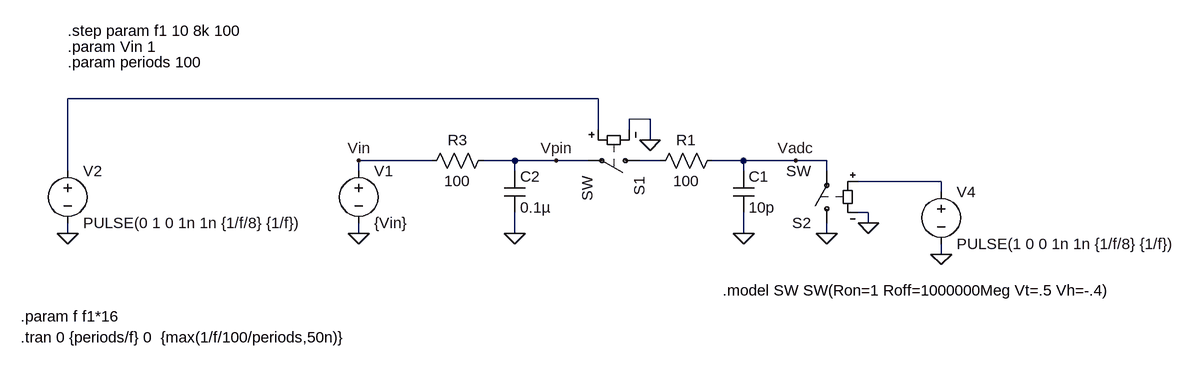
[diagram p0: schematic SettleTime.asc]
SettleTime.asc, the LTspice schematic file:
Version 4
SHEET 1 1796 680
WIRE 48 48 -768 48
WIRE 128 80 96 80
WIRE 48 96 48 48
WIRE 96 96 96 80
WIRE 128 112 128 80
WIRE -208 144 -320 144
WIRE -80 144 -128 144
WIRE -16 144 -80 144
WIRE 32 144 -16 144
WIRE 144 144 112 144
WIRE 272 144 224 144
WIRE 352 144 272 144
WIRE 400 144 352 144
WIRE -768 160 -768 48
WIRE -320 160 -320 144
WIRE -80 160 -80 144
WIRE 272 160 272 144
WIRE 400 160 400 144
WIRE 576 176 448 176
WIRE 576 192 576 176
WIRE 464 224 448 224
WIRE 464 240 464 224
WIRE -768 256 -768 240
WIRE -320 256 -320 240
WIRE -80 256 -80 224
WIRE 272 256 272 224
WIRE 400 256 400 240
WIRE 576 288 576 272
FLAG 272 256 0
FLAG -80 256 0
FLAG -320 256 0
FLAG 128 112 0
FLAG -768 256 0
FLAG -320 144 Vin
FLAG 352 144 Vadc
FLAG 464 240 0
FLAG 576 288 0
FLAG -16 144 Vpin
FLAG 400 256 0
SYMBOL cap 256 160 R0
SYMATTR InstName C1
SYMATTR Value 10p
SYMBOL res 240 128 R90
WINDOW 0 0 56 VBottom 2
WINDOW 3 32 56 VTop 2
SYMATTR InstName R1
SYMATTR Value 100
SYMBOL res -112 128 R90
WINDOW 0 0 56 VBottom 2
WINDOW 3 32 56 VTop 2
SYMATTR InstName R3
SYMATTR Value 100
SYMBOL cap -96 160 R0
SYMATTR InstName C2
SYMATTR Value 0.1µ
SYMBOL voltage -320 144 R0
WINDOW 123 0 0 Left 0
WINDOW 39 0 0 Left 0
SYMATTR InstName V1
SYMATTR Value {Vin}
SYMBOL sw 128 144 R90
SYMATTR InstName S1
SYMBOL voltage -768 144 R0
WINDOW 123 0 0 Left 0
WINDOW 39 0 0 Left 0
SYMATTR InstName V2
SYMATTR Value PULSE(0 1 0 1n 1n {1/f/8} {1/f})
SYMBOL sw 400 256 R180
SYMATTR InstName S2
SYMBOL voltage 576 176 R0
WINDOW 123 0 0 Left 0
WINDOW 39 0 0 Left 0
SYMATTR InstName V4
SYMATTR Value PULSE(1 0 0 1n 1n {1/f/8} {1/f})
TEXT 240 344 Left 2 !.model SW SW(Ron=1 Roff=1000000Meg Vt=.5 Vh=-.4)
TEXT -840 416 Left 2 !.tran 0 {periods/f} 0  {max(1/f/100/periods,50n)}
TEXT -768 -32 Left 2 !.param Vin 1
TEXT -840 384 Left 2 !.param f f1*16
TEXT -768 -56 Left 2 !.step param f1 10 8k 100
TEXT -768 -8 Left 2 !.param periods 100

The netlist it stands for:
* SettleTime.asc
C1 Vadc 0 10p
R1 Vadc N002 100
R3 Vpin Vin 100
C2 Vpin 0 0.1µ
V1 Vin 0 {Vin}
S1 N002 Vpin N001 0 SW
V2 N001 0 PULSE(0 1 0 1n 1n {1/f/8} {1/f})
S2 0 Vadc N003 0 SW
V4 N003 0 PULSE(1 0 0 1n 1n {1/f/8} {1/f})
.model SW SW(Ron=1 Roff=1000000Meg Vt=.5 Vh=-.4)
.tran 0 {periods/f} 0  {max(1/f/100/periods,50n)}
.param Vin 1
.param f f1*16
.step param f1 10 8k 100
.param periods 100
.backanno
.end